# Altium schematic sheet BSU_Power.SchDoc: Power
size A4; Sub Team: EEE; Organization: PERT; SheetNumber: 3; SheetTotal: 8
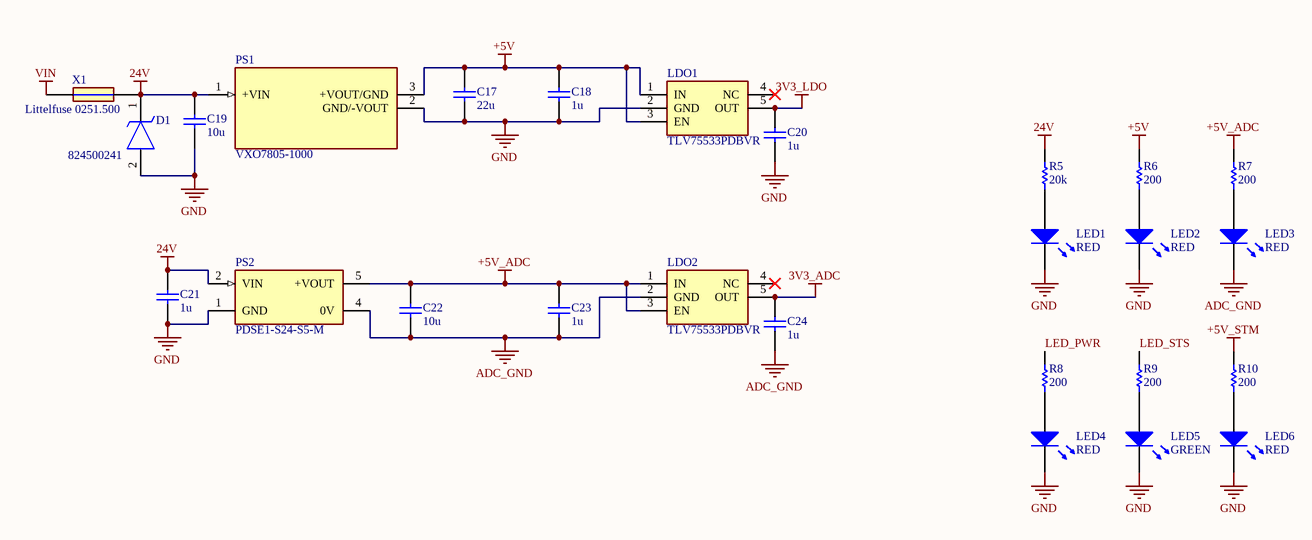
[diagram p0: BSU_Power.SchDoc]

## Parts
C17  22u  [0805_SMD_C]
C18  1u  [0805_SMD_C]
C19  10u  [0805_SMD_C]
C20  1u  [0805_SMD_C]
C21  1u  [0805_SMD_C]
C22  10u  [0805_SMD_C]
C23  1u  [0805_SMD_C]
C24  1u  [0805_SMD_C]
D1  824500241  [SMA_824500241]
LDO1  TLV75533PDBVR  [SOT23-5_TLV75533]
LDO2  TLV75533PDBVR  [SOT23-5_TLV75533]
LED1  RED  [0805_SMD_LED]
LED2  RED  [0805_SMD_LED]
LED3  RED  [0805_SMD_LED]
LED4  RED  [0805_SMD_LED]
LED5  GREEN  [0805_SMD_LED]
LED6  RED  [0805_SMD_LED]
PS1  VXO7805-1000  [VXO78xx-1000]
PS2  PDSE1-S24-S5-M  [PDSE1-Sxx-Sx-M]
R5  20k  [0805_SMD_R]
R6  200  [0805_SMD_R]
R7  200  [0805_SMD_R]
R8  200  [0805_SMD_R]
R9  200  [0805_SMD_R]
R10  200  [0805_SMD_R]
X1  Littelfuse 0251.500  [LITTELFUSE 0251]

## Nets
3V3_ADC: C24.2 LDO2.5(OUT)
3V3_LDO: C20.2 LDO1.5(OUT)
24V: C19.2 C21.2 D1.1(K) PS1.1(+VIN) PS2.2(VIN) R5.2 X1.2
+5V: C17.2 C18.2 LDO1.1(IN) LDO1.3(EN) PS1.3(+VOUT/GND) R6.2
+5V_ADC: C22.2 C23.2 LDO2.1(IN) LDO2.3(EN) PS2.5(+VOUT) R7.2
+5V_STM: R10.2
ADC_GND: C22.1 C23.1 C24.1 LDO2.2(GND) LED3.1 PS2.4(0V)
GND: C17.1 C18.1 C19.1 C20.1 C21.1 D1.2(A) LDO1.2(GND) LED1.1 LED2.1 LED4.1 LED5.1 LED6.1 PS1.2(GND/-VOUT) PS2.1(GND)
VIN: X1.1
LED_PWR: R8.2
LED_STS: R9.2
NetLED1_2: LED1.2 R5.1
NetLED2_2: LED2.2 R6.1
NetLED3_2: LED3.2 R7.1
NetLED4_2: LED4.2 R8.1
NetLED5_2: LED5.2 R9.1
NetLED6_2: LED6.2 R10.1

Not connected (* = marked no-connect by the designer): LDO1 4(NC)*; LDO2 4(NC)*

## Notes on the sheet
- Title
- Generation
- Organization
- Sub Team
- Module
- Ver.
- Rev.
- Date
- Draw By

## Library data of the parts
C17 C18 C22 C23 = 0805_SMD_Capacitor: 0805 SMD Capacitor; Voltage Rating: 16VDC; Tolerance: *; Dielectric: *
  C17: Value: 22u
  C18 C23: Value: 1u
  C22: Value: 10u
C19 C21 = 0805_SMD_Capacitor: 0805 SMD Capacitor; Voltage Rating: 50VDC; Tolerance: *; Dielectric: *
  C19: Value: 10u
  C21: Value: 1u
C20 C24 = 0805_SMD_Capacitor: 0805 SMD Capacitor; Voltage Rating: 10VDC; Tolerance: *; Dielectric: *; Value: 1u
D1 = 824500241: TVS Diode (Uni-directional); Manufacturer_Name: Wurth Elektronik; Datasheet Link: https://componentsearchengine.com/Datasheets/2/824500241.pdf; Height: 2.5mm; Manufacturer_Part_Number: 824500241; Mouser Part Number: 710-824500241; Mouser Price/Stock: https://www.mouser.co.uk/ProductDetail/Wurth-Elektronik/824500241?qs=16w8nSHsg3swPBRQBjzwDQ%3D%3D
LDO1 LDO2 = 3V 500mA LDO: LDO Voltage Regulators 500-mA, Low IQ, Small Size, Low Dropout Regulator 5-SOT-23 -40 to 125; Manufacturer_Name: Texas Instruments; Geometry.Height: 1.45mm; Mouser Part Number: 595-TLV75533PDBVR; Mouser Price/Stock: https://www.mouser.co.uk/ProductDetail/Texas-Instruments/TLV75533PDBVR?qs=55YtniHzbhAKEwqeO2xJXQ%3D%3D; Manufacturer_Part_Number: TLV75533PDBVR; Datasheet Link: http://www.ti.com/lit/gpn/tlv755p
LED1-LED6 = 0805 LED Generic: SMD LED
PS1 = 24-5 Power Converter: CUI Inc.,1 A Output Current, 6~36 Vdc Input, 3 Pin SIP, Non-Isolated, Dc-Dc Converter; MF: CUI Inc.; Package: SIP-3; Value: *; Price: None; MP: VXO7805-1000; SnapEDA_Link: https://www.snapeda.com/parts/VXO7805-1000/CUI/view-part/2679745/?ref=snap; Availability: Unavailable; Supplier 1: Mouser; Supplier 2: Digi-Key; Supplier Part Number 2: 102-4258-ND; Supplier Part Number 1: 490-VXO7805-1000
PS2 = 24-5 Isolated Power Converter: CUI Inc., DC-DC ISOLATED, 5VDC input, 1 W, 4.5-5.5 VDC; MF: {'manufacturer': u'CUI'}; Availability: Unavailable; Package: None; MP: PDSE1-S24-S5-M; Value: *; Price: None; Supplier 1: Mouser; Supplier 2: Digi-Key; Supplier Part Number 1: 490-PDSE1-S24-S5-M; Supplier Part Number 2: 102-PDSE1-S24-S5-M-ND
R5-R10 = 0805_SMD_Resistor: 0805 SMD Resistor; Tolerance: *; Power Rating: *; Temperature Coefficient: *
  R5: Value: 20k
  R6-R10: Value: 200
X1 = LV Fuse 500mA: Littelfuse 251 series 125VAC/125VDC 500mA